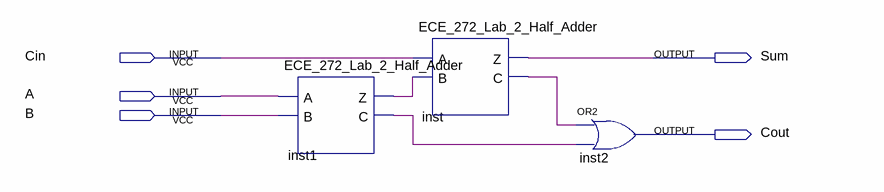
[diagram p0: schematic sheet]
// Quartus schematic ECE_272_Lab_2_Full_Adder.bdf as structural Verilog: 3 symbols, 5 pins
module ECE_272_Lab_2_Full_Adder (
  input  Cin,
  input  A,
  input  B,
  output Sum,
  output Cout
);

  wire inst1_c, inst1_z, inst_c;

  ECE_272_Lab_2_Half_Adder inst1 (.A(A), .B(B), .Z(inst1_z), .C(inst1_c));
  ECE_272_Lab_2_Half_Adder inst (.A(Cin), .B(inst1_z), .Z(Sum), .C(inst_c));
  or inst2 (Cout, inst_c, inst1_c);
endmodule
